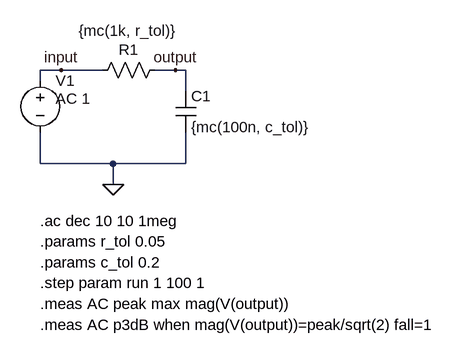
[diagram p0: schematic RC-Tiefpass_AC-Analyse.asc]
RC-Tiefpass_AC-Analyse.asc, the LTspice schematic file:
Version 4
SHEET 1 1028 680
WIRE -16 64 -48 64
WIRE 48 64 -16 64
WIRE 160 64 128 64
WIRE 176 64 160 64
WIRE -48 80 -48 64
WIRE 176 96 176 64
WIRE -48 208 -48 160
WIRE 64 208 -48 208
WIRE 176 208 176 160
WIRE 176 208 64 208
WIRE 64 240 64 208
FLAG 64 240 0
FLAG -16 64 input
FLAG 160 64 output
SYMBOL res 32 80 R270
WINDOW 0 32 56 VTop 2
WINDOW 3 92 55 VBottom 2
SYMATTR InstName R1
SYMATTR Value {mc(1k, r_tol)}
SYMBOL cap 160 96 R0
SYMATTR InstName C1
SYMATTR Value {mc(100n, c_tol)}
SYMBOL voltage -48 64 R0
WINDOW 123 24 44 Left 2
WINDOW 39 0 0 Left 2
SYMATTR Value2 AC 1
SYMATTR InstName V1
SYMATTR Value ""
TEXT -48 296 Left 2 !.ac dec 10 10 1meg
TEXT -48 328 Left 2 !.params r_tol 0.05
TEXT -48 360 Left 2 !.params c_tol 0.2
TEXT -48 392 Left 2 !.step param run 1 100 1
TEXT -48 456 Left 2 !.meas AC p3dB when mag(V(output))=peak/sqrt(2) fall=1
TEXT -48 424 Left 2 !.meas AC peak max mag(V(output))

The netlist it stands for:
* RC-Tiefpass_AC-Analyse.asc
R1 input output {mc(1k, r_tol)}
C1 output 0 {mc(100n, c_tol)}
V1 input 0 AC 1
.ac dec 10 10 1meg
.params r_tol 0.05
.params c_tol 0.2
.step param run 1 100 1
.meas AC p3dB when mag(V(output))=peak/sqrt(2) fall=1
.meas AC peak max mag(V(output))
.backanno
.end